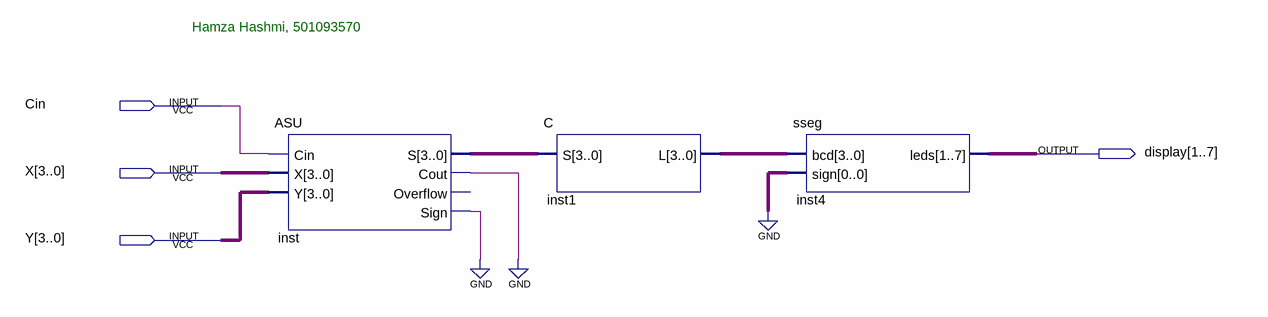
[diagram p0: schematic sheet]
// Quartus schematic CombinedASU2.bdf as structural Verilog: 3 symbols, 4 pins
module CombinedASU2 (
  input  Cin,
  input  [3:0] X,
  input  [3:0] Y,
  output [1:7] display
);

  wire inst_cout, inst_sign;
  wire [3:0] inst1_l, inst_s;

  ASU inst (.Cin(Cin), .X(X), .Y(Y), .S(inst_s), .Cout(inst_cout), .Sign(inst_sign));  // open: Overflow
  C inst1 (.S(inst_s), .L(inst1_l));
  sseg inst4 (.bcd(inst1_l), .sign(1'b0), .leds(display));
  // also tied to GND on the sheet: {inst_sign, inst_cout}

  // Notes on the sheet:
  //   Hamza Hashmi, 501093570
endmodule
